# Altium schematic sheet Line-Detection.SchDoc
size A; SheetNumber: 5; SheetTotal: 8
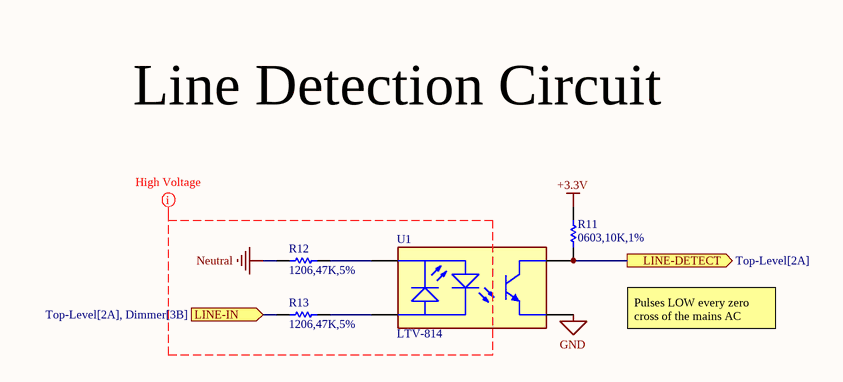
[diagram p0: Line-Detection.SchDoc]

## Parts
R11  0603,10K,1%  [RESC1608X55N]
R12  1206,47K,5%  [RESC3116X65N]
R13  1206,47K,5%  [RESC3116X65N]
U1  LTV-814  [DIP-4_L6.5-W4.6-P2.54-LS7.6-BL]

## Ports
LINE-DETECT (out, see Top-Level[2A]), LINE-IN (in, see Top-Level[2A], Dimmer[3B])

## Nets
+3.3V: R11.2
GND: U1.3(Emitter)
Neutral: R12.1
LINE-DETECT: R11.1 U1.4(Collector) ; port LINE-DETECT
LINE-IN: R13.1 ; port LINE-IN
NetR12_2: R12.2 U1.1(Anode/Cathode)
NetR13_2: R13.2 U1.2(Anode/Cathode)

## Layout directives
net class High-Voltage: Neutral

## Notes on the sheet
- Line Detection Circuit
- Pulses LOW every zero cross of the mains AC

## Library data of the parts
R11 = RC0603FR-0710KL: 100mW Thick Film Resistor 75V ±100ppm/℃ ±1% 10kΩ 0603 Chip Resistor - Surface Mount ROHS; Manufacturer_Name: YAGEO; Datasheet Link: https://www.mouser.in/datasheet/2/447/PYu_RC_Group_51_RoHS_L_11-1984063.pdf; Height: 0.55mm; Manufacturer_Part_Number: RC0603FR-0710KL; Mouser Part Number: 603-RC0603FR-0710KL; Mouser Price/Stock: https://www.mouser.co.uk/ProductDetail/YAGEO/RC0603FR-0710KL?qs=grNVn54RoB%252B3GtjbJj3wJQ%3D%3D; Arrow Part Number: RC0603FR-0710KL; Arrow Price/Stock: https://www.arrow.com/en/products/rc0603fr-0710kl/yageo?utm_currency=USD&region=nac; LCSC Part Number: C98220
R12 R13 = RC1206JR-7W47KL: 500mW Thick Film Resistor ±5% ±200ppm/℃ 47kΩ 1206 Chip Resistor - Surface Mount ROHS; MP: RC1206JR-070RL; MF: Yageo; Purchase-URL: https://pricing.snapeda.com/search/part/RC1206JR-070RL/?ref=eda; Package: 1206 Yageo; Availability: In Stock; Check_prices: https://www.snapeda.com/parts/RC1206JR-070RL/Yageo/view-part/?ref=eda; Value: *; SnapEDA_Link: https://www.snapeda.com/parts/RC1206JR-070RL/Yageo/view-part/?ref=snap; Price: None; LCSC Part Number: C20164413
U1 = LTV-814: 35V 5kV 50mA 100mV@20mA,1mA 1 1.2V DC SMD-4P Transistor, Photovoltaic Output Optoisolators ROHS; LCSC Part Number: C10790